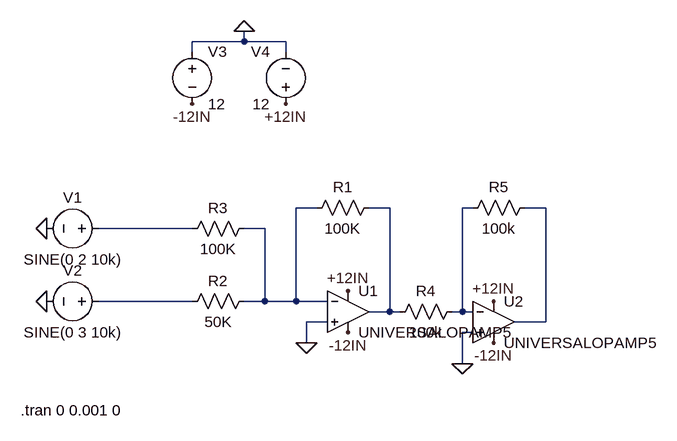
[diagram p0: schematic Adder Circuit.asc]
Adder Circuit.asc, the LTspice schematic file:
Version 4.1
SHEET 1 880 680
WIRE 0 -304 0 -320
WIRE 0 -304 -80 -304
WIRE 64 -304 0 -304
WIRE -80 -288 -80 -304
WIRE 64 -288 64 -304
WIRE 112 -48 80 -48
WIRE 224 -48 192 -48
WIRE 352 -48 336 -48
WIRE 464 -48 432 -48
WIRE -80 -16 -224 -16
WIRE 32 -16 0 -16
WIRE -80 96 -224 96
WIRE 32 96 32 -16
WIRE 32 96 0 96
WIRE 80 96 80 -48
WIRE 80 96 32 96
WIRE 128 96 80 96
WIRE 224 112 224 -48
WIRE 224 112 192 112
WIRE 240 112 224 112
WIRE 336 112 336 -48
WIRE 336 112 320 112
WIRE 352 112 336 112
WIRE 128 128 96 128
WIRE 464 128 464 -48
WIRE 464 128 416 128
WIRE 352 144 336 144
WIRE 96 160 96 128
WIRE 336 192 336 144
FLAG 96 160 0
FLAG -304 -16 0
FLAG -304 96 0
FLAG 0 -320 0
FLAG -80 -208 -12IN
FLAG 160 144 -12IN
FLAG 64 -208 +12IN
FLAG 160 80 +12IN
FLAG 336 192 0
FLAG 384 96 +12IN
FLAG 384 160 -12IN
SYMBOL OpAmps\\UniversalOpAmp5 160 112 R0
SYMATTR InstName U1
SYMBOL res 208 -64 R90
WINDOW 0 0 56 VBottom 2
WINDOW 3 32 56 VTop 2
SYMATTR InstName R1
SYMATTR Value 100K
SYMBOL res 16 80 R90
WINDOW 0 0 56 VBottom 2
WINDOW 3 32 56 VTop 2
SYMATTR InstName R2
SYMATTR Value 50K
SYMBOL res 16 -32 R90
WINDOW 0 0 56 VBottom 2
WINDOW 3 32 56 VTop 2
SYMATTR InstName R3
SYMATTR Value 100K
SYMBOL voltage -208 -16 R90
WINDOW 0 -32 56 VBottom 2
WINDOW 3 32 56 VTop 2
WINDOW 123 0 0 Left 0
WINDOW 39 0 0 Left 0
SYMATTR InstName V1
SYMATTR Value SINE(0 2 10k)
SYMBOL voltage -208 96 R90
WINDOW 0 -32 56 VBottom 2
WINDOW 3 32 56 VTop 2
WINDOW 123 0 0 Left 0
WINDOW 39 0 0 Left 0
SYMATTR InstName V2
SYMATTR Value SINE(0 3 10k)
SYMBOL voltage -80 -304 R0
WINDOW 123 0 0 Left 0
WINDOW 39 0 0 Left 0
SYMATTR InstName V3
SYMATTR Value 12
SYMBOL voltage 64 -192 R180
WINDOW 0 24 96 Left 2
WINDOW 3 24 16 Left 2
WINDOW 123 0 0 Left 0
WINDOW 39 0 0 Left 0
SYMATTR InstName V4
SYMATTR Value 12
SYMBOL OpAmps\\UniversalOpAmp5 384 128 R0
SYMATTR InstName U2
SYMBOL res 336 96 R90
WINDOW 0 0 56 VBottom 2
WINDOW 3 32 56 VTop 2
SYMATTR InstName R4
SYMATTR Value 100k
SYMBOL res 448 -64 R90
WINDOW 0 0 56 VBottom 2
WINDOW 3 32 56 VTop 2
SYMATTR InstName R5
SYMATTR Value 100k
TEXT -344 264 Left 2 !.tran 0 0.001 0

The netlist it stands for:
* Adder Circuit.asc
X§U1 0 N001 +12IN -12IN N002 level5 Avol=1Meg GBW=10Meg Phimargin=45 SlewPos=10Meg SlewNeg=10Meg En=0 Enk=0 In=0 Ink=0 Rcm=500Meg Ccm=1p Rdiff=500k Cdiff=2p Ro=1k Vos=0 Ibp=2n Ibn=1n Iq=1m Rail=0 Ilimit=25m  ; UNIVERSALOPAMP5, pins In+ In- V+ V- OUT
R1 N002 N001 100K
R2 N001 N006 50K
R3 N001 N005 100K
V1 N005 0 SINE(0 2 10k)
V2 N006 0 SINE(0 3 10k)
V3 0 -12IN 12
V4 +12IN 0 12
X§U2 0 N003 +12IN -12IN N004 level5 Avol=1Meg GBW=10Meg Phimargin=45 SlewPos=10Meg SlewNeg=10Meg En=0 Enk=0 In=0 Ink=0 Rcm=500Meg Ccm=1p Rdiff=500k Cdiff=2p Ro=1k Vos=0 Ibp=2n Ibn=1n Iq=1m Rail=0 Ilimit=25m  ; UNIVERSALOPAMP5, pins In+ In- V+ V- OUT
R4 N003 N002 100k
R5 N004 N003 100k
.tran 0 0.001 0
.backanno
.end